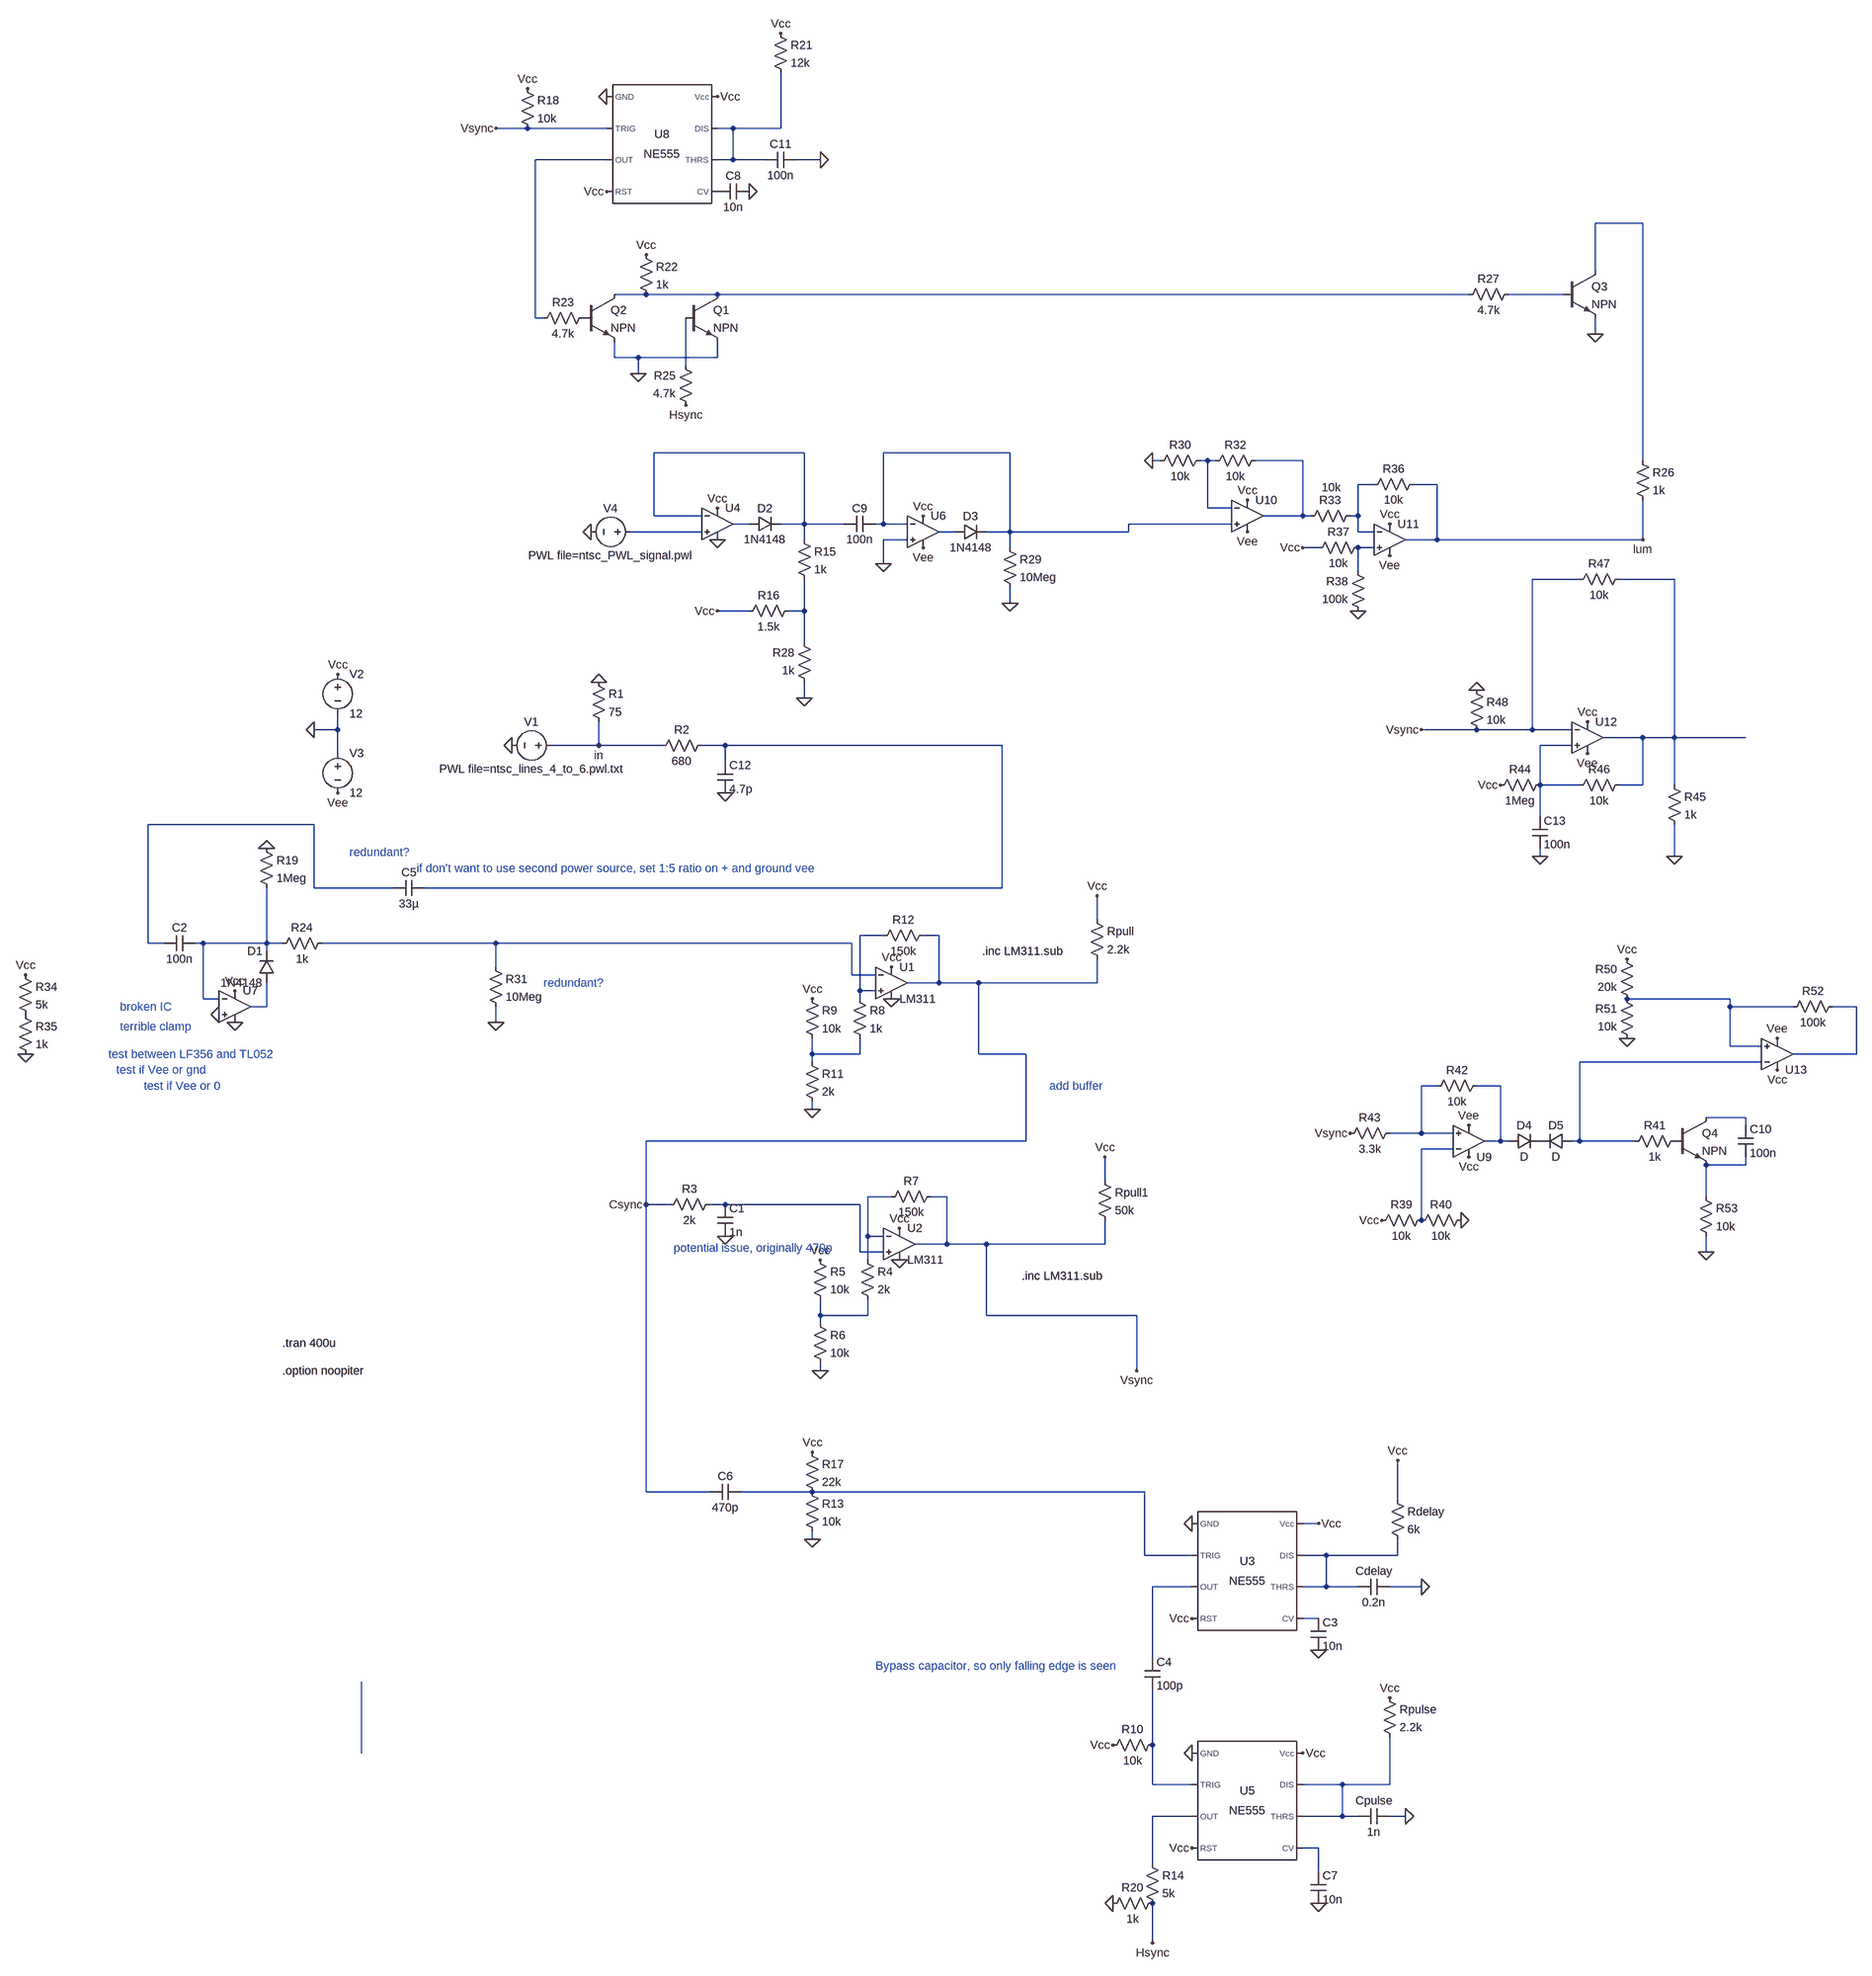
[diagram p0: schematic postFailure.asc]
postFailure.asc, the LTspice schematic file:
Version 4.1
SHEET 1 4812 2948
WIRE 16 -1440 -48 -1440
WIRE 176 -1440 16 -1440
WIRE 432 -1440 400 -1440
WIRE 528 -1440 528 -1552
WIRE 528 -1440 432 -1440
WIRE 176 -1376 32 -1376
WIRE 432 -1376 432 -1440
WIRE 432 -1376 400 -1376
WIRE 496 -1376 432 -1376
WIRE 608 -1376 560 -1376
WIRE 2272 -1248 2176 -1248
WIRE 2176 -1152 2176 -1248
WIRE 256 -1104 192 -1104
WIRE 400 -1104 256 -1104
WIRE 1920 -1104 400 -1104
WIRE 2112 -1104 2000 -1104
WIRE 32 -1056 32 -1376
WIRE 48 -1056 32 -1056
WIRE 2176 -1024 2176 -1056
WIRE 192 -976 192 -1008
WIRE 240 -976 192 -976
WIRE 400 -976 400 -1008
WIRE 400 -976 240 -976
WIRE 336 -960 336 -1056
WIRE 240 -944 240 -976
WIRE 576 -784 272 -784
WIRE 992 -784 736 -784
WIRE 1296 -768 1280 -768
WIRE 1392 -768 1376 -768
WIRE 1408 -768 1392 -768
WIRE 1584 -768 1488 -768
WIRE 2272 -768 2272 -1248
WIRE 1728 -720 1696 -720
WIRE 1856 -720 1808 -720
WIRE 1392 -672 1392 -768
WIRE 1440 -672 1392 -672
WIRE 272 -656 272 -784
WIRE 368 -656 272 -656
WIRE 1584 -656 1584 -768
WIRE 1584 -656 1504 -656
WIRE 1600 -656 1584 -656
WIRE 1696 -656 1696 -720
WIRE 1696 -656 1680 -656
WIRE 464 -640 432 -640
WIRE 576 -640 576 -784
WIRE 576 -640 528 -640
WIRE 656 -640 576 -640
WIRE 736 -640 736 -784
WIRE 736 -640 720 -640
WIRE 784 -640 736 -640
WIRE 1440 -640 1232 -640
WIRE 368 -624 224 -624
WIRE 880 -624 848 -624
WIRE 992 -624 992 -784
WIRE 992 -624 944 -624
WIRE 1232 -624 1232 -640
WIRE 1232 -624 992 -624
WIRE 1696 -624 1696 -656
WIRE 1728 -624 1696 -624
WIRE 576 -608 576 -640
WIRE 784 -608 736 -608
WIRE 1856 -608 1856 -720
WIRE 1856 -608 1792 -608
WIRE 2272 -608 2272 -688
WIRE 2272 -608 1856 -608
WIRE 992 -592 992 -624
WIRE 1616 -592 1584 -592
WIRE 1728 -592 1696 -592
WIRE 736 -560 736 -608
WIRE 1696 -544 1696 -592
WIRE 2144 -528 2048 -528
WIRE 2336 -528 2224 -528
WIRE 992 -480 992 -512
WIRE 464 -464 400 -464
WIRE 576 -464 576 -528
WIRE 576 -464 544 -464
WIRE 576 -400 576 -464
WIRE 576 -288 576 -320
WIRE -368 -224 -368 -256
WIRE -368 -224 -416 -224
WIRE 1936 -224 1824 -224
WIRE 2048 -224 2048 -528
WIRE 2048 -224 1936 -224
WIRE 2128 -224 2048 -224
WIRE 2272 -208 2192 -208
WIRE 2336 -208 2336 -528
WIRE 2336 -208 2272 -208
WIRE 2480 -208 2336 -208
WIRE 160 -192 160 -240
WIRE 160 -192 64 -192
WIRE 288 -192 160 -192
WIRE 416 -192 368 -192
WIRE 976 -192 416 -192
WIRE 2128 -192 2064 -192
WIRE -368 -176 -368 -224
WIRE 416 -160 416 -192
WIRE 2064 -112 2064 -192
WIRE 2144 -112 2064 -112
WIRE 2272 -112 2272 -208
WIRE 2272 -112 2224 -112
WIRE 2336 -112 2336 -208
WIRE 2064 -48 2064 -112
WIRE -416 -32 -752 -32
WIRE 2064 32 2064 16
WIRE 2336 32 2336 -32
WIRE -416 96 -416 -32
WIRE -256 96 -416 96
WIRE 976 96 976 -192
WIRE 976 96 -192 96
WIRE 1168 160 1168 112
WIRE 736 192 688 192
WIRE 848 192 816 192
WIRE -752 208 -752 -32
WIRE -720 208 -752 208
WIRE -640 208 -656 208
WIRE -512 208 -512 96
WIRE -512 208 -640 208
WIRE -480 208 -512 208
WIRE -48 208 -400 208
WIRE 672 208 -48 208
WIRE -512 224 -512 208
WIRE -48 256 -48 208
WIRE 672 272 672 208
WIRE 720 272 672 272
WIRE 848 288 848 192
WIRE 848 288 784 288
WIRE 928 288 848 288
WIRE 1168 288 1168 240
WIRE 1168 288 928 288
WIRE 688 304 688 192
WIRE 720 304 688 304
WIRE -640 320 -640 208
WIRE -608 320 -640 320
WIRE 688 320 688 304
WIRE 2448 320 2240 320
WIRE -512 336 -512 288
WIRE -512 336 -544 336
WIRE 2448 336 2448 320
WIRE 2576 336 2448 336
WIRE 2704 336 2656 336
WIRE -48 368 -48 336
WIRE 2448 416 2448 336
WIRE 2512 416 2448 416
WIRE 592 432 592 400
WIRE 688 432 688 400
WIRE 688 432 592 432
WIRE 928 432 928 288
WIRE 1024 432 928 432
WIRE 2704 432 2704 336
WIRE 2704 432 2576 432
WIRE 592 448 592 432
WIRE 2512 448 2144 448
WIRE 1856 496 1824 496
WIRE 1984 496 1936 496
WIRE 592 544 592 528
WIRE 2480 560 2400 560
WIRE 2480 576 2480 560
WIRE 1824 592 1824 496
WIRE 1824 592 1760 592
WIRE 1888 592 1824 592
WIRE 1024 608 1024 432
WIRE 1024 608 256 608
WIRE 1984 608 1984 496
WIRE 1984 608 1952 608
WIRE 2000 608 1984 608
WIRE 2144 608 2144 448
WIRE 2144 608 2128 608
WIRE 2256 608 2144 608
WIRE 1888 624 1824 624
WIRE 2480 656 2480 640
WIRE 2480 656 2400 656
WIRE 1184 688 1184 640
WIRE 752 720 704 720
WIRE 864 720 832 720
WIRE 2400 720 2400 656
WIRE 256 736 256 608
WIRE 304 736 256 736
WIRE 416 736 384 736
WIRE 688 736 416 736
WIRE 1824 768 1824 624
WIRE 704 800 704 720
WIRE 736 800 704 800
WIRE 864 816 864 720
WIRE 864 816 800 816
WIRE 944 816 864 816
WIRE 1184 816 1184 768
WIRE 1184 816 944 816
WIRE 688 832 688 736
WIRE 736 832 688 832
WIRE 2400 832 2400 800
WIRE 704 848 704 800
WIRE 608 960 608 928
WIRE 704 960 704 928
WIRE 704 960 608 960
WIRE 944 960 944 816
WIRE 1248 960 944 960
WIRE 608 976 608 960
WIRE 608 1072 608 1056
WIRE 1248 1072 1248 960
WIRE 256 1632 256 736
WIRE 384 1632 256 1632
WIRE 592 1632 448 1632
WIRE 1264 1632 592 1632
WIRE 1776 1648 1776 1568
WIRE 1616 1696 1584 1696
WIRE 592 1728 592 1712
WIRE 1264 1760 1264 1632
WIRE 1360 1760 1264 1760
WIRE 1632 1760 1584 1760
WIRE 1776 1760 1776 1728
WIRE 1776 1760 1632 1760
WIRE 1360 1824 1280 1824
WIRE 1632 1824 1632 1760
WIRE 1632 1824 1584 1824
WIRE 1696 1824 1632 1824
WIRE 1824 1824 1760 1824
WIRE 1616 1888 1584 1888
WIRE 1280 1968 1280 1824
WIRE 1280 2144 1280 2032
WIRE -320 2160 -320 2016
WIRE 1280 2224 1280 2144
WIRE 1360 2224 1280 2224
WIRE 1664 2224 1584 2224
WIRE 1760 2224 1760 2128
WIRE 1760 2224 1664 2224
WIRE 1360 2288 1280 2288
WIRE 1664 2288 1664 2224
WIRE 1664 2288 1584 2288
WIRE 1696 2288 1664 2288
WIRE 1792 2288 1760 2288
WIRE 1616 2352 1584 2352
WIRE 1280 2384 1280 2288
WIRE 1616 2400 1616 2352
WIRE 1280 2544 1280 2464
FLAG -16 -192 0
FLAG 160 -320 0
FLAG 416 -96 0
FLAG 592 544 0
FLAG 752 256 Vcc
FLAG -368 -336 Vcc
FLAG -368 -96 Vee
FLAG -416 -224 0
FLAG 1168 112 Vcc
FLAG 592 320 Vcc
FLAG -48 368 0
FLAG 416 800 0
FLAG -576 304 Vcc
FLAG 608 1072 0
FLAG 1184 640 Vcc
FLAG 608 848 Vcc
FLAG 768 848 0
FLAG 1248 1072 Vsync
FLAG 256 736 Csync
FLAG 1360 1696 0
FLAG 1360 1888 Vcc
FLAG -1056 432 0
FLAG -1056 272 Vcc
FLAG -608 352 0
FLAG 160 -192 in
FLAG 768 784 Vcc
FLAG -576 368 0
FLAG 752 320 0
FLAG -512 16 0
FLAG 1616 1696 Vcc
FLAG 1776 1568 Vcc
FLAG 1824 1824 0
FLAG 1616 1952 0
FLAG 1200 2144 Vcc
FLAG 1360 2160 0
FLAG 1584 2160 Vcc
FLAG 1760 2048 Vcc
FLAG 1792 2288 0
FLAG 1360 2352 Vcc
FLAG 1280 2544 Hsync
FLAG 1616 2464 0
FLAG 1200 2464 0
FLAG 592 1552 Vcc
FLAG 592 1728 0
FLAG 176 -1504 0
FLAG 400 -1504 Vcc
FLAG 176 -1312 Vcc
FLAG 16 -1520 Vcc
FLAG -48 -1440 Vsync
FLAG 464 -1312 0
FLAG 528 -1632 Vcc
FLAG 608 -1376 0
FLAG 240 -944 0
FLAG 256 -1184 Vcc
FLAG 336 -880 Hsync
FLAG 2272 -608 lum
FLAG 2176 -1024 0
FLAG 144 -624 0
FLAG 400 -672 Vcc
FLAG 400 -608 0
FLAG 400 -464 Vcc
FLAG 576 -288 0
FLAG 736 -560 0
FLAG 992 -480 0
FLAG 816 -656 Vcc
FLAG 816 -592 Vee
FLAG 1472 -688 Vcc
FLAG 1472 -624 Vee
FLAG 1280 -768 0
FLAG 1696 -464 0
FLAG 1584 -592 Vcc
FLAG 1760 -640 Vcc
FLAG 1760 -576 Vee
FLAG 1920 640 Vcc
FLAG 1920 576 Vee
FLAG 1904 768 0
FLAG 1744 768 Vcc
FLAG 1680 592 Vsync
FLAG 2544 464 Vcc
FLAG 2544 400 Vee
FLAG 2240 240 Vcc
FLAG 2240 400 0
FLAG 2400 832 0
FLAG 1824 -224 Vsync
FLAG 2160 -240 Vcc
FLAG 2160 -176 Vee
FLAG 2336 32 0
FLAG 2064 32 0
FLAG 1984 -112 Vcc
FLAG 1936 -304 0
DATAFLAG 592 432 ""
DATAFLAG 608 960 ""
DATAFLAG 1248 960 ""
SYMBOL voltage 80 -192 R90
WINDOW 0 -32 56 VBottom 2
WINDOW 3 32 56 VTop 2
WINDOW 123 0 0 Left 0
WINDOW 39 0 0 Left 0
SYMATTR InstName V1
SYMATTR Value PWL file=ntsc_lines_4_to_6.pwl.txt
SYMBOL res 144 -336 R0
SYMATTR InstName R1
SYMATTR Value 75
SYMBOL res 384 -208 R90
WINDOW 0 0 56 VBottom 2
WINDOW 3 32 56 VTop 2
SYMATTR InstName R2
SYMATTR Value 680
SYMBOL cap 400 -160 R0
SYMATTR InstName C12
SYMATTR Value 4.7p
SYMBOL res 672 304 R0
SYMATTR InstName R8
SYMATTR Value 1k
SYMBOL res 576 304 R0
SYMATTR InstName R9
SYMATTR Value 10k
SYMBOL res 576 432 R0
SYMATTR InstName R11
SYMATTR Value 2k
SYMBOL res 832 176 R90
WINDOW 0 0 56 VBottom 2
WINDOW 3 32 56 VTop 2
SYMATTR InstName R12
SYMATTR Value 150k
SYMBOL res 1152 144 R0
SYMATTR InstName Rpull
SYMATTR Value 2.2k
SYMBOL voltage -368 -352 R0
SYMATTR InstName V2
SYMATTR Value 12
SYMBOL voltage -368 -192 R0
SYMATTR InstName V3
SYMATTR Value 12
SYMBOL OpAmps\\opamp2 752 224 R0
SYMATTR InstName U1
SYMATTR Value LM311
SYMBOL res -64 240 R0
SYMATTR InstName R31
SYMATTR Value 10Meg
SYMBOL res 400 720 R90
WINDOW 0 0 56 VBottom 2
WINDOW 3 32 56 VTop 2
SYMATTR InstName R3
SYMATTR Value 2k
SYMBOL cap 400 736 R0
SYMATTR InstName C1
SYMATTR Value 1n
SYMBOL res -384 192 R90
WINDOW 0 0 56 VBottom 2
WINDOW 3 32 56 VTop 2
SYMATTR InstName R24
SYMATTR Value 1k
SYMBOL diode -496 288 R180
WINDOW 0 24 64 Left 2
WINDOW 3 24 0 Left 2
SYMATTR InstName D1
SYMATTR Value 1N4148
SYMBOL cap -656 192 R90
WINDOW 0 0 32 VBottom 2
WINDOW 3 32 32 VTop 2
SYMATTR InstName C2
SYMATTR Value 100n
SYMBOL OpAmps\\UniversalOpAmp2 -576 336 R0
SYMATTR InstName U7
SYMBOL res 688 832 R0
SYMATTR InstName R4
SYMATTR Value 2k
SYMBOL res 592 832 R0
SYMATTR InstName R5
SYMATTR Value 10k
SYMBOL res 592 960 R0
SYMATTR InstName R6
SYMATTR Value 10k
SYMBOL res 848 704 R90
WINDOW 0 0 56 VBottom 2
WINDOW 3 32 56 VTop 2
SYMATTR InstName R7
SYMATTR Value 150k
SYMBOL res 1168 672 R0
SYMATTR InstName Rpull1
SYMATTR Value 50k
SYMBOL OpAmps\\opamp2 768 752 R0
SYMATTR InstName U2
SYMATTR Value LM311
SYMBOL Misc\\NE555 1472 1792 R0
SYMATTR InstName U3
SYMBOL res -1072 256 R0
SYMATTR InstName R34
SYMATTR Value 5k
SYMBOL res -1072 336 R0
SYMATTR InstName R35
SYMATTR Value 1k
SYMBOL res -528 0 R0
SYMATTR InstName R19
SYMATTR Value 1Meg
SYMBOL cap -192 80 R90
WINDOW 0 0 32 VBottom 2
WINDOW 3 32 32 VTop 2
SYMATTR InstName C5
SYMATTR Value 33µ
SYMBOL res 1760 1632 R0
SYMATTR InstName Rdelay
SYMATTR Value 6k
SYMBOL cap 1760 1808 R90
WINDOW 0 0 32 VBottom 2
WINDOW 3 32 32 VTop 2
SYMATTR InstName Cdelay
SYMATTR Value 0.2n
SYMBOL cap 1600 1888 R0
SYMATTR InstName C3
SYMATTR Value 10n
SYMBOL cap 1264 1968 R0
SYMATTR InstName C4
SYMATTR Value 100p
SYMBOL res 1296 2128 R90
WINDOW 0 0 56 VBottom 2
WINDOW 3 32 56 VTop 2
SYMATTR InstName R10
SYMATTR Value 10k
SYMBOL Misc\\NE555 1472 2256 R0
SYMATTR InstName U5
SYMBOL res 1744 2032 R0
SYMATTR InstName Rpulse
SYMATTR Value 2.2k
SYMBOL cap 1760 2272 R90
WINDOW 0 0 32 VBottom 2
WINDOW 3 32 32 VTop 2
SYMATTR InstName Cpulse
SYMATTR Value 1n
SYMBOL cap 1600 2400 R0
SYMATTR InstName C7
SYMATTR Value 10n
SYMBOL res 576 1616 R0
SYMATTR InstName R13
SYMATTR Value 10k
SYMBOL cap 448 1616 R90
WINDOW 0 0 32 VBottom 2
WINDOW 3 32 32 VTop 2
SYMATTR InstName C6
SYMATTR Value 470p
SYMBOL res 1264 2368 R0
SYMATTR InstName R14
SYMATTR Value 5k
SYMBOL res 1296 2448 R90
WINDOW 0 0 56 VBottom 2
WINDOW 3 32 56 VTop 2
SYMATTR InstName R20
SYMATTR Value 1k
SYMBOL res 576 1536 R0
SYMATTR InstName R17
SYMATTR Value 22k
SYMBOL Misc\\NE555 288 -1408 R0
SYMATTR InstName U8
SYMBOL res 0 -1536 R0
SYMATTR InstName R18
SYMATTR Value 10k
SYMBOL cap 464 -1328 R90
WINDOW 0 0 32 VBottom 2
WINDOW 3 32 32 VTop 2
SYMATTR InstName C8
SYMATTR Value 10n
SYMBOL res 512 -1648 R0
SYMATTR InstName R21
SYMATTR Value 12k
SYMBOL cap 560 -1392 R90
WINDOW 0 0 32 VBottom 2
WINDOW 3 32 32 VTop 2
SYMATTR InstName C11
SYMATTR Value 100n
SYMBOL npn 336 -1104 R0
SYMATTR InstName Q1
SYMBOL npn 128 -1104 R0
SYMATTR InstName Q2
SYMBOL res 240 -1200 R0
SYMATTR InstName R22
SYMATTR Value 1k
SYMBOL res 144 -1072 R90
WINDOW 0 0 56 VBottom 2
WINDOW 3 32 56 VTop 2
SYMATTR InstName R23
SYMATTR Value 4.7k
SYMBOL res 352 -864 R180
WINDOW 0 36 76 Left 2
WINDOW 3 36 40 Left 2
SYMATTR InstName R25
SYMATTR Value 4.7k
SYMBOL res 2256 -784 R0
SYMATTR InstName R26
SYMATTR Value 1k
SYMBOL npn 2112 -1152 R0
SYMATTR InstName Q3
SYMBOL res 2016 -1120 R90
WINDOW 0 0 56 VBottom 2
WINDOW 3 32 56 VTop 2
SYMATTR InstName R27
SYMATTR Value 4.7k
SYMBOL voltage 240 -624 R90
WINDOW 0 -32 56 VBottom 2
WINDOW 3 32 56 VTop 2
WINDOW 123 0 0 Left 0
WINDOW 39 0 0 Left 0
SYMATTR InstName V4
SYMATTR Value PWL file=ntsc_PWL_signal.pwl
SYMBOL OpAmps\\UniversalOpAmp2 400 -640 R0
SYMATTR InstName U4
SYMBOL diode 464 -624 R270
WINDOW 0 32 32 VTop 2
WINDOW 3 0 32 VBottom 2
SYMATTR InstName D2
SYMATTR Value 1N4148
SYMBOL res 560 -624 R0
SYMATTR InstName R15
SYMATTR Value 1k
SYMBOL res 560 -480 R90
WINDOW 0 0 56 VBottom 2
WINDOW 3 32 56 VTop 2
SYMATTR InstName R16
SYMATTR Value 1.5k
SYMBOL res 592 -304 R180
WINDOW 0 36 76 Left 2
WINDOW 3 36 40 Left 2
SYMATTR InstName R28
SYMATTR Value 1k
SYMBOL cap 720 -656 R90
WINDOW 0 0 32 VBottom 2
WINDOW 3 32 32 VTop 2
SYMATTR InstName C9
SYMATTR Value 100n
SYMBOL OpAmps\\UniversalOpAmp2 816 -624 R0
SYMATTR InstName U6
SYMBOL res 976 -608 R0
SYMATTR InstName R29
SYMATTR Value 10Meg
SYMBOL diode 880 -608 R270
WINDOW 0 32 32 VTop 2
WINDOW 3 0 32 VBottom 2
SYMATTR InstName D3
SYMATTR Value 1N4148
SYMBOL OpAmps\\UniversalOpAmp2 1472 -656 R0
SYMATTR InstName U10
SYMBOL res 1392 -784 R90
WINDOW 0 0 56 VBottom 2
WINDOW 3 32 56 VTop 2
SYMATTR InstName R30
SYMATTR Value 10k
SYMBOL res 1504 -784 R90
WINDOW 0 0 56 VBottom 2
WINDOW 3 32 56 VTop 2
SYMATTR InstName R32
SYMATTR Value 10k
SYMBOL res 1696 -672 R90
WINDOW 0 0 56 VBottom 2
WINDOW 3 -57 54 VTop 2
SYMATTR InstName R33
SYMATTR Value 10k
SYMBOL OpAmps\\UniversalOpAmp2 1760 -608 R0
SYMATTR InstName U11
SYMBOL res 1824 -736 R90
WINDOW 0 0 56 VBottom 2
WINDOW 3 32 56 VTop 2
SYMATTR InstName R36
SYMATTR Value 10k
SYMBOL res 1712 -608 R90
WINDOW 0 0 56 VBottom 2
WINDOW 3 32 56 VTop 2
SYMATTR InstName R37
SYMATTR Value 10k
SYMBOL res 1712 -448 R180
WINDOW 0 36 76 Left 2
WINDOW 3 36 40 Left 2
SYMATTR InstName R38
SYMATTR Value 100k
SYMBOL OpAmps\\UniversalOpAmp2 1920 608 M180
SYMATTR InstName U9
SYMBOL res 1840 752 R90
WINDOW 0 0 56 VBottom 2
WINDOW 3 32 56 VTop 2
SYMATTR InstName R39
SYMATTR Value 10k
SYMBOL res 1920 752 R90
WINDOW 0 0 56 VBottom 2
WINDOW 3 32 56 VTop 2
SYMATTR InstName R40
SYMATTR Value 10k
SYMBOL res 2352 592 R90
WINDOW 0 0 56 VBottom 2
WINDOW 3 32 56 VTop 2
SYMATTR InstName R41
SYMATTR Value 1k
SYMBOL npn 2336 560 R0
SYMATTR InstName Q4
SYMBOL cap 2464 576 R0
SYMATTR InstName C10
SYMATTR Value 100n
SYMBOL res 1952 480 R90
WINDOW 0 0 56 VBottom 2
WINDOW 3 32 56 VTop 2
SYMATTR InstName R42
SYMATTR Value 10k
SYMBOL res 1776 576 R90
WINDOW 0 0 56 VBottom 2
WINDOW 3 32 56 VTop 2
SYMATTR InstName R43
SYMATTR Value 3.3k
SYMBOL OpAmps\\UniversalOpAmp2 2544 432 M180
SYMATTR InstName U13
SYMBOL res 2256 336 R180
WINDOW 0 36 76 Left 2
WINDOW 3 36 40 Left 2
SYMATTR InstName R50
SYMATTR Value 20k
SYMBOL res 2256 416 R180
WINDOW 0 36 76 Left 2
WINDOW 3 36 40 Left 2
SYMATTR InstName R51
SYMATTR Value 10k
SYMBOL res 2672 320 R90
WINDOW 0 0 56 VBottom 2
WINDOW 3 32 56 VTop 2
SYMATTR InstName R52
SYMATTR Value 100k
SYMBOL diode 2000 624 R270
WINDOW 0 32 32 VTop 2
WINDOW 3 0 32 VBottom 2
SYMATTR InstName D4
SYMBOL diode 2128 592 R90
WINDOW 0 0 32 VBottom 2
WINDOW 3 32 32 VTop 2
SYMATTR InstName D5
SYMBOL res 2384 704 R0
SYMATTR InstName R53
SYMATTR Value 10k
SYMBOL OpAmps\\UniversalOpAmp2 2160 -208 R0
SYMATTR InstName U12
SYMBOL res 2320 -128 R0
SYMATTR InstName R45
SYMATTR Value 1k
SYMBOL res 2240 -128 R90
WINDOW 0 0 56 VBottom 2
WINDOW 3 32 56 VTop 2
SYMATTR InstName R46
SYMATTR Value 10k
SYMBOL cap 2048 -48 R0
SYMATTR InstName C13
SYMATTR Value 100n
SYMBOL res 2080 -128 R90
WINDOW 0 0 56 VBottom 2
WINDOW 3 32 56 VTop 2
SYMATTR InstName R44
SYMATTR Value 1Meg
SYMBOL res 2240 -544 R90
WINDOW 0 0 56 VBottom 2
WINDOW 3 32 56 VTop 2
SYMATTR InstName R47
SYMATTR Value 10k
SYMBOL res 1920 -320 R0
SYMATTR InstName R48
SYMATTR Value 10k
TEXT -480 1016 Left 2 !.tran 400u
TEXT 936 224 Left 2 !.inc LM311.sub
TEXT 1016 880 Left 2 !.inc LM311.sub
TEXT -208 56 Left 2 ;if don't want to use second power source, set 1:5 ratio on + and ground vee
TEXT -808 336 Left 2 ;broken IC
TEXT -808 376 Left 2 ;terrible clamp
TEXT -832 432 Left 2 ;test between LF356 and TL052
TEXT 48 288 Left 2 ;redundant?
TEXT -344 24 Left 2 ;redundant?
TEXT -816 464 Left 2 ;test if Vee or gnd
TEXT 720 1984 Left 2 ;Bypass capacitor, so only falling edge is seen
TEXT -480 1072 Left 2 !.option noopiter
TEXT 1072 496 Left 2 ;add buffer
TEXT -760 496 Left 2 ;test if Vee or 0
TEXT 312 824 Left 2 ;potential issue, originally 470p

The netlist it stands for:
* postFailure.asc
V1 in 0 PWL file=ntsc_lines_4_to_6.pwl.txt
R1 0 in 75
R2 N018 in 680
C12 N018 0 4.7p
R8 N021 N027 1k
R9 Vcc N027 10k
R11 N027 0 2k
R12 Csync N021 150k
Rpull Vcc Csync 2.2k
V2 Vcc 0 12
V3 0 Vee 12
X§U1 N021 N023 Vcc 0 Csync LM311  ; pins In+ In- V+ V- OUT
R31 N023 0 10Meg
R3 N035 Csync 2k
C1 N035 0 1n
R24 N023 N022 1k
D1 N025 N022 1N4148
C2 N022 N020 100n
X§U7 0 N022 Vcc 0 N025 level2 Avol=1Meg GBW=10Meg Slew=10Meg Ilimit=25m Rail=0 Vos=0 En=0 Enk=0 In=0 Ink=0 Rin=500Meg  ; pins In+ In- V+ V- OUT
R4 N034 N036 2k
R5 Vcc N036 10k
R6 N036 0 10k
R7 Vsync N034 150k
Rpull1 Vcc Vsync 50k
X§U2 N035 N034 Vcc 0 Vsync LM311  ; pins In+ In- V+ V- OUT
X§U3 0 N037 N039 Vcc N040 N038 N038 Vcc NE555  ; pins GND TRIG OUT RST CV THRS DIS Vcc
R34 Vcc P001 5k
R35 P001 0 1k
R19 0 N022 1Meg
C5 N018 N020 33µ
Rdelay Vcc N038 6k
Cdelay 0 N038 0.2n
C3 N040 0 10n
C4 N039 N041 100p
R10 N041 Vcc 10k
X§U5 0 N041 N044 Vcc N045 N043 N043 Vcc NE555  ; pins GND TRIG OUT RST CV THRS DIS Vcc
Rpulse Vcc N043 2.2k
Cpulse 0 N043 1n
C7 N045 0 10n
R13 N037 0 10k
C6 N037 Csync 470p
R14 N044 Hsync 5k
R20 Hsync 0 1k
R17 Vcc N037 22k
X§U8 0 Vsync N002 Vcc P002 N001 N001 Vcc NE555  ; pins GND TRIG OUT RST CV THRS DIS Vcc
R18 Vcc Vsync 10k
C8 0 P002 10n
R21 Vcc N001 12k
C11 0 N001 100n
Q1 N004 N006 0 0 NPN
Q2 N004 P003 0 0 NPN
R22 Vcc N004 1k
R23 P003 N002 4.7k
R25 Hsync N006 4.7k
R26 N003 lum 1k
Q3 N003 N005 0 0 NPN
R27 N005 N004 4.7k
V4 N013 0 PWL file=ntsc_PWL_signal.pwl
X§U4 N013 N007 Vcc 0 N012 level2 Avol=1Meg GBW=10Meg Slew=10Meg Ilimit=25m Rail=0 Vos=0 En=0 Enk=0 In=0 Ink=0 Rin=500Meg  ; pins In+ In- V+ V- OUT
D2 N012 N007 1N4148
R15 N007 N017 1k
R16 N017 Vcc 1.5k
R28 0 N017 1k
C9 N008 N007 100n
X§U6 0 N008 Vcc Vee N014 level2 Avol=1Meg GBW=10Meg Slew=10Meg Ilimit=25m Rail=0 Vos=0 En=0 Enk=0 In=0 Ink=0 Rin=500Meg  ; pins In+ In- V+ V- OUT
R29 N008 0 10Meg
D3 N014 N008 1N4148
X§U10 N008 N009 Vcc Vee N010 level2 Avol=1Meg GBW=10Meg Slew=10Meg Ilimit=25m Rail=0 Vos=0 En=0 Enk=0 In=0 Ink=0 Rin=500Meg  ; pins In+ In- V+ V- OUT
R30 N009 0 10k
R32 N010 N009 10k
R33 N011 N010 10k
X§U11 N015 N011 Vcc Vee lum level2 Avol=1Meg GBW=10Meg Slew=10Meg Ilimit=25m Rail=0 Vos=0 En=0 Enk=0 In=0 Ink=0 Rin=500Meg  ; pins In+ In- V+ V- OUT
R36 lum N011 10k
R37 N015 Vcc 10k
R38 0 N015 100k
X§U9 N029 N032 Vcc Vee N030 level2 Avol=1Meg GBW=10Meg Slew=10Meg Ilimit=25m Rail=0 Vos=0 En=0 Enk=0 In=0 Ink=0 Rin=500Meg  ; pins In+ In- V+ V- OUT
R39 N032 Vcc 10k
R40 0 N032 10k
R41 P004 N028 1k
Q4 N031 P004 N033 0 NPN
C10 N031 N033 100n
R42 N030 N029 10k
R43 N029 Vsync 3.3k
X§U13 N024 N028 Vcc Vee N026 level2 Avol=1Meg GBW=10Meg Slew=10Meg Ilimit=25m Rail=0 Vos=0 En=0 Enk=0 In=0 Ink=0 Rin=500Meg  ; pins In+ In- V+ V- OUT
R50 N024 Vcc 20k
R51 0 N024 10k
R52 N026 N024 100k
D4 N030 P005 D
D5 N028 P005 D
R53 N033 0 10k
X§U12 N019 Vsync Vcc Vee N016 level2 Avol=1Meg GBW=10Meg Slew=10Meg Ilimit=25m Rail=0 Vos=0 En=0 Enk=0 In=0 Ink=0 Rin=500Meg  ; pins In+ In- V+ V- OUT
R45 N016 0 1k
R46 N016 N019 10k
C13 N019 0 100n
R44 N019 Vcc 1Meg
R47 N016 Vsync 10k
R48 0 Vsync 10k
.model D D
.lib standard.dio
.model NPN NPN
.model PNP PNP
.lib standard.bjt
.tran 400u
.inc LM311.sub
.inc LM311.sub
* if don't want to use second power source, set 1:5 ratio on + and ground vee
* broken IC
* terrible clamp
* test between LF356 and TL052
* redundant?
* redundant?
* test if Vee or gnd
* Bypass capacitor, so only falling edge is seen
.option noopiter
* add buffer
* test if Vee or 0
* potential issue, originally 470p
.lib UniversalOpAmp2.lib
.lib NE555.sub
.backanno
.end